# EAGLE design ember_20110430 (EAGLE 5.11)
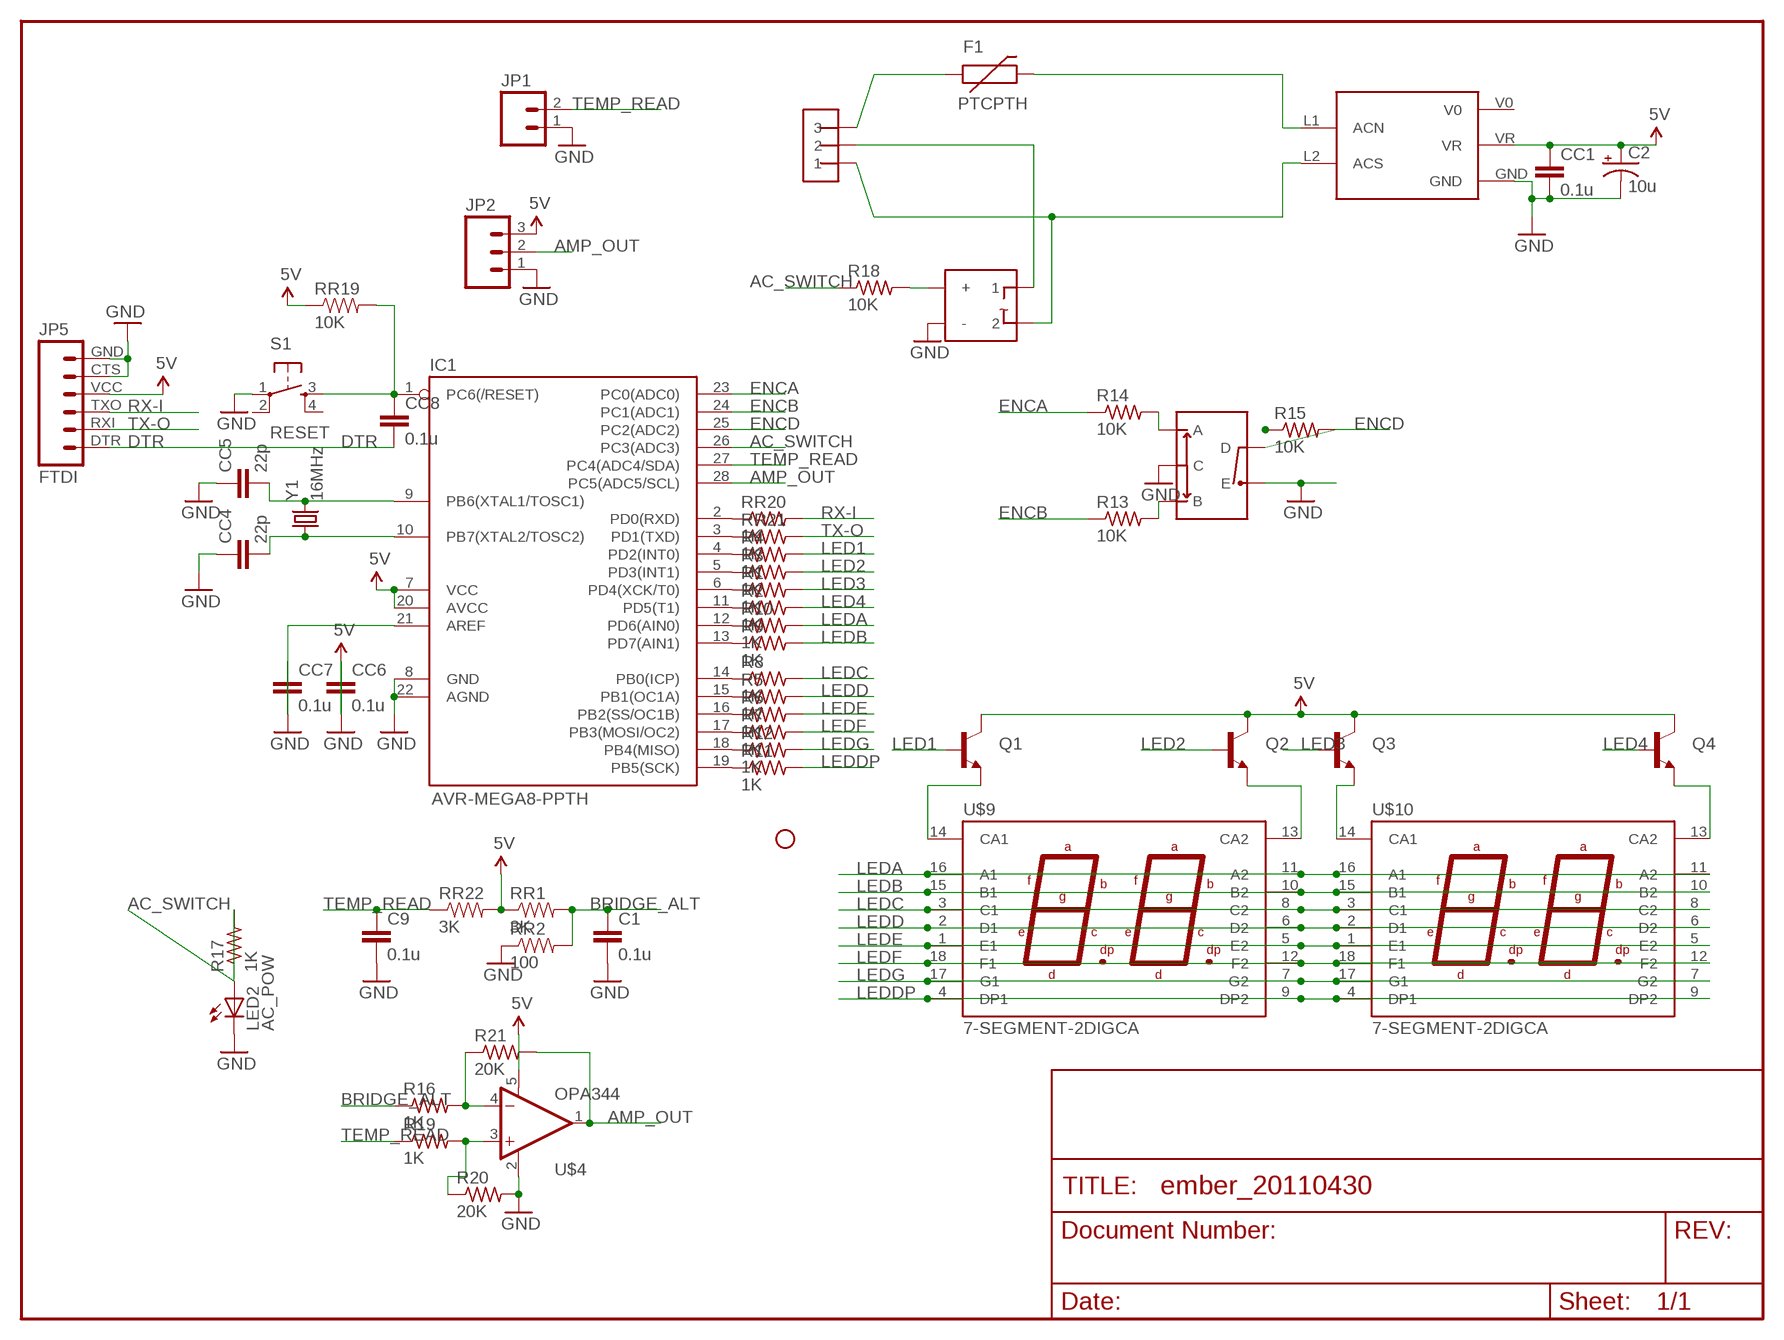
[diagram p0: schematic, sheet 1]

## Parts
C1  0.1u  CAPPTH  [CAP-PTH-SMALL]
C2  10u  CAP_POLPTH2  [CPOL-RADIAL-10UF-25V]
C9  0.1u  CAPPTH  [CAP-PTH-SMALL]
CC1  0.1u  CAPPTH  [CAP-PTH-SMALL]
CC4  22p  CAPPTH  [CAP-PTH-SMALL]
CC5  22p  CAPPTH  [CAP-PTH-SMALL]
CC6  0.1u  CAPPTH  [CAP-PTH-SMALL]
CC7  0.1u  CAPPTH  [CAP-PTH-SMALL]
CC8  0.1u  CAPPTH  [CAP-PTH-SMALL]
F1  PTCPTH  [PTC]
IC1  AVR-MEGA8-PPTH  [DIL28-3]
JP1  M023.5MM_LOCK  [SCREWTERMINAL-3.5MM-2_LOCK]
JP2  M03SCREW_LOCK  [SCREWTERMINAL-3.5MM-3_LOCK.007S]
JP5  FTDI  FTDI_BASICPTH  [FTDI_BASIC]
JP7  M03V5V75  [M03V75]
JP8  STAND-OFF  [STAND-OFF]
LED2  AC_POW  LED3MM  [LED3MM]
Q1  TRANSISTOR_NPNTO92  [TO-92]
Q2  TRANSISTOR_NPNTO92  [TO-92]
Q3  TRANSISTOR_NPNTO92  [TO-92]
Q4  TRANSISTOR_NPNTO92  [TO-92]
R1  1K  R-US_0207/2V  [0207/2V]
R2  1K  R-US_0207/2V  [0207/2V]
R3  1K  R-US_0207/2V  [0207/2V]
R4  1K  R-US_0207/2V  [0207/2V]
R5  1K  R-US_0207/2V  [0207/2V]
R6  1K  R-US_0207/2V  [0207/2V]
R7  1K  R-US_0207/2V  [0207/2V]
R8  1K  R-US_0207/2V  [0207/2V]
R9  1K  R-US_0207/2V  [0207/2V]
R10  1K  R-US_0207/2V  [0207/2V]
R11  1K  R-US_0207/2V  [0207/2V]
R12  1K  R-US_0207/2V  [0207/2V]
R13  10K  R-US_0207/2V  [0207/2V]
R14  10K  R-US_0207/2V  [0207/2V]
R15  10K  R-US_0207/2V  [0207/2V]
R16  1K  R-US_0207/2V  [0207/2V]
R17  1K  R-US_0207/2V  [0207/2V]
R18  10K  R-US_0207/2V  [0207/2V]
R19  1K  R-US_0207/2V  [0207/2V]
R20  20K  R-US_0207/2V  [0207/2V]
R21  20K  R-US_0207/2V  [0207/2V]
RR1  3K  RESISTORAXIAL-0.3  [AXIAL-0.3]
RR2  100  RESISTORAXIAL-0.3  [AXIAL-0.3]
RR19  10K  RESISTORAXIAL-0.3  [AXIAL-0.3]
RR20  1K  R-US_0207/2V  [0207/2V]
RR21  1K  R-US_0207/2V  [0207/2V]
RR22  3K  RESISTORAXIAL-0.3  [AXIAL-0.3]
S1  RESET  TAC_SWITCHPTH  [TACTILE-PTH]
U$3  POWER_SUPPLY  [BIAS_PWR_1W]
U$4  OPA344  [SOT23-5]
U$9  7-SEGMENT-2DIGCA  [7-SEGMENT-DISPLAY]
U$10  7-SEGMENT-2DIGCA  [7-SEGMENT-DISPLAY]
U$16  SSR  [SIP-SSR]
U$17  ENCODER  [ENCODER-BOURNES-PEC11]
Y1  16MHz  CRYSTALHC49UV  [HC49U-V]

## Nets
5V: C2.1(+) CC1.1 CC6.2 IC1.7(VCC) IC1.20(AVCC) JP2.3 JP5.VCC Q1.3(C) Q2.3(C) Q3.3(C) Q4.3(C) RR1.P$1 RR19.P$1 RR22.P$2 U$3.VR U$4.5(V+)
AC_SWITCH: IC1.26(PC3(ADC3)) R17.1 R18.1
AMP_OUT: IC1.28(PC5(ADC5/SCL)) JP2.2 R21.2 U$4.1(OUT)
BRIDGE_ALT: C1.1 R16.1 RR1.P$2 RR2.P$2
DTR: CC8.2 JP5.DTR
ENCA: IC1.23(PC0(ADC0)) R14.1
ENCB: IC1.24(PC1(ADC1)) R13.1
ENCD: IC1.25(PC2(ADC2)) R15.1
GND: C1.2 C2.2(-) C9.2 CC1.2 CC4.1 CC5.1 CC6.1 CC7.1 IC1.8(GND) IC1.22(AGND) JP1.1 JP2.1 JP5.CTS JP5.GND LED2.K(C) R20.2 RR2.P$1 S1.1 U$3.GND U$4.2(V-) U$16.4(-) U$17.C U$17.E
LED1: Q1.2(B) R4.2
LED2: Q2.2(B) R3.2
LED3: Q3.2(B) R1.2
LED4: Q4.2(B) R2.2
LEDA: R10.2 U$9.11(A2) U$9.16(A1) U$10.11(A2) U$10.16(A1)
LEDB: R9.2 U$9.10(B2) U$9.15(B1) U$10.10(B2) U$10.15(B1)
LEDC: R8.2 U$9.3(C1) U$9.8(C2) U$10.3(C1) U$10.8(C2)
LEDD: R5.2 U$9.2(D1) U$9.6(D2) U$10.2(D1) U$10.6(D2)
LEDDP: R11.2 U$9.4(DP1) U$9.9(DP2) U$10.4(DP1) U$10.9(DP2)
LEDE: R6.2 U$9.1(E1) U$9.5(E2) U$10.1(E1) U$10.5(E2)
LEDF: R7.2 U$9.12(F2) U$9.18(F1) U$10.12(F2) U$10.18(F1)
LEDG: R12.2 U$9.7(G2) U$9.17(G1) U$10.7(G2) U$10.17(G1)
N$1: IC1.4(PD2(INT0)) R4.1
N$2: IC1.5(PD3(INT1)) R3.1
N$3: Q4.1(E) U$10.13(CA2)
N$4: IC1.6(PD4(XCK/T0)) R1.1
N$5: LED2.A R17.2
N$6: CC5.2 IC1.9(PB6(XTAL1/TOSC1)) Y1.2
N$7: CC4.2 IC1.10(PB7(XTAL2/TOSC2)) Y1.1
N$8: IC1.11(PD5(T1)) R2.1
N$9: IC1.12(PD6(AIN0)) R10.1
N$10: IC1.13(PD7(AIN1)) R9.1
N$11: IC1.14(PB0(ICP)) R8.1
N$12: IC1.15(PB1(OC1A)) R5.1
N$13: IC1.2(PD0(RXD)) RR20.1
N$14 [1A/150]: F1.P$2 U$3.L1(ACN)
N$15: IC1.16(PB2(SS/OC1B)) R6.1
N$16: Q3.1(E) U$10.14(CA1)
N$17: Q2.1(E) U$9.13(CA2)
N$18: Q1.1(E) U$9.14(CA1)
N$19: IC1.17(PB3(MOSI/OC2)) R7.1
N$20: CC7.2 IC1.21(AREF)
N$21: IC1.18(PB4(MISO)) R12.1
N$22: IC1.19(PB5(SCK)) R11.1
N$23 [1A/150]: JP7.2 U$16.1
N$24: R18.2 U$16.3(+)
N$25: R16.2 R21.1 U$4.4(-IN)
N$26: R19.2 R20.1 U$4.3(+IN)
N$33: R14.2 U$17.A
N$34: R13.2 U$17.B
N$35: IC1.3(PD1(TXD)) RR21.1
N$36: R15.2 U$17.D
N$37 [1A/150]: F1.P$1 JP7.3
N$38 [1A/150]: JP7.1 U$3.L2(ACS) U$16.2
RESET: CC8.1 IC1.1(PC6(/RESET)) RR19.P$2 S1.3
RX-I: JP5.TXO RR20.2
TEMP_READ: C9.1 IC1.27(PC4(ADC4/SDA)) JP1.2 R19.1 RR22.P$1
TX-O: JP5.RXI RR21.2
Unconnected: S1.2 S1.4 U$3.V0

## Library data of the parts
C1 C9 CC1 CC4-CC8 = SparkFun:CAP: Capacitor Standard 0603 ceramic capacitor, and 0.1" leaded capacitor.
C2 = SparkFun:CAP_POL: Capacitor Polarized These are standard SMD and PTH capacitors. Normally 10uF, 47uF, and 100uF in electrolytic and tantalum varieties. Always verify the external diameter of the through hole cap, it varies with capacity, voltage, and manufacturer. The EIA devices should be standard.
F1 = SparkFun:PTC: Resettable Fuse PTC Resettable Fuse. Spark Fun Electronics SKU : COM-08357
IC1 = SparkFun:AVR-MEGA8-P: MICROCONTROLLER 8 Kbytes FLASH 1 kbytes SRAM 512 bytes EEPROM USART 4-channel 10 bit ADC 2-channel 8 bit ADC
JP1 = SparkFun:M02: Header 2 Standard 2-pin 0.1" header. Use with straight break away headers (SKU : PRT-00116), right angle break away headers (PRT-00553), swiss pins (PRT-00743), machine pins (PRT-00117), and female headers (PRT-00115). Molex polarized connector foot print use with SKU : PRT-08233 with associated crimp pins and housings.
JP2 = SparkFun:M03: Header 3 Standard 3-pin 0.1" header. Use with straight break away headers (SKU : PRT-00116), right angle break away headers (PRT-00553), swiss pins (PRT-00743), machine pins (PRT-00117), and female headers (PRT-00115). Molex polarized connector foot print use with SKU : PRT-08232 with associated crimp pins and housings.
JP5 = SparkFun:FTDI_BASIC: FTDI Basic: 3.3V and 5V
JP7 = User:M03V5
JP8 = SparkFun:STAND-OFF: Stand Off This is the mechanical footprint for a #4 phillips button head screw. Use the keepout ring to avoid running the screw head into surrounding components. SKU : PRT-00447
LED2 = SparkFun:LED: LEDs Standard schematic elements and footprints for 5mm, 3mm, 1206, and 0603 sized LEDs. 5mm - Spark Fun Electronics SKU : COM-00529 (and others)
Q1-Q4 = SparkFun:TRANSISTOR_NPN: Transistor NPN BJT configuration in SOT23 package. MMBT2222 is the common NPN we use. Double check BCE configuration again layout.
R1-R21 RR20 RR21 = rcl:R-US_: RESISTOR, American symbol
RR1 RR2 RR19 RR22 = SparkFun:RESISTOR: Resistor Basic schematic elements and footprints for 0603, 1206, and PTH resistors.
S1 = SparkFun:TAC_SWITCH: Momentary Switch Button commonly used for reset or general input. Spark Fun Electronics SKU : COM-00097
U$3 = User:POWER_SUPPLY
U$4 = SparkFun:OPA344
U$9 U$10 = User:7-SEGMENT-2DIG
U$16 = User:SSR
U$17 = User:ENCODER
Y1 = SparkFun:CRYSTAL: Crystals Various standard crystals. Proven footprints. Spark Fun Electronics SKU : COM-00534

## Net classes
1 10A/150: width 2.54 mm, clearance 1.854 mm
2 1A/150: width 0.102 mm, clearance 1.854 mm

## Board
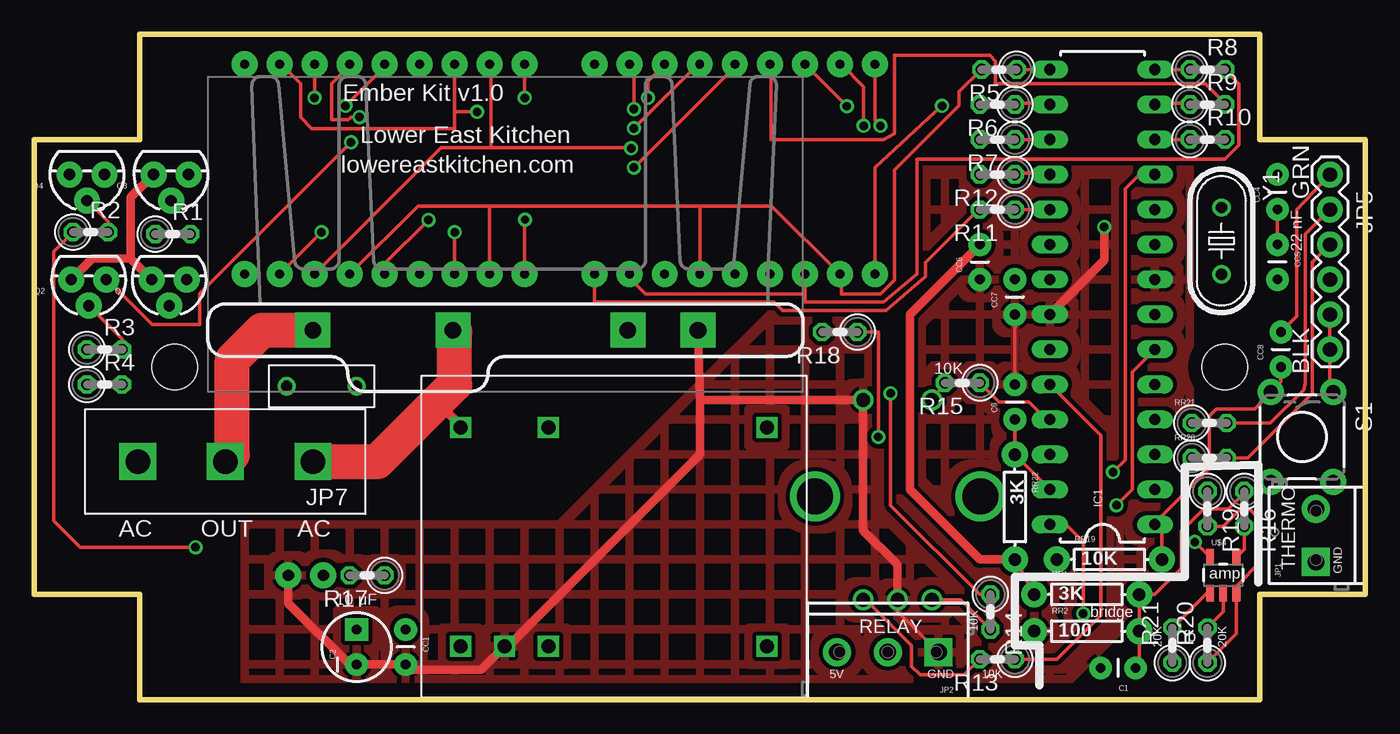
[diagram p1: board, top side]
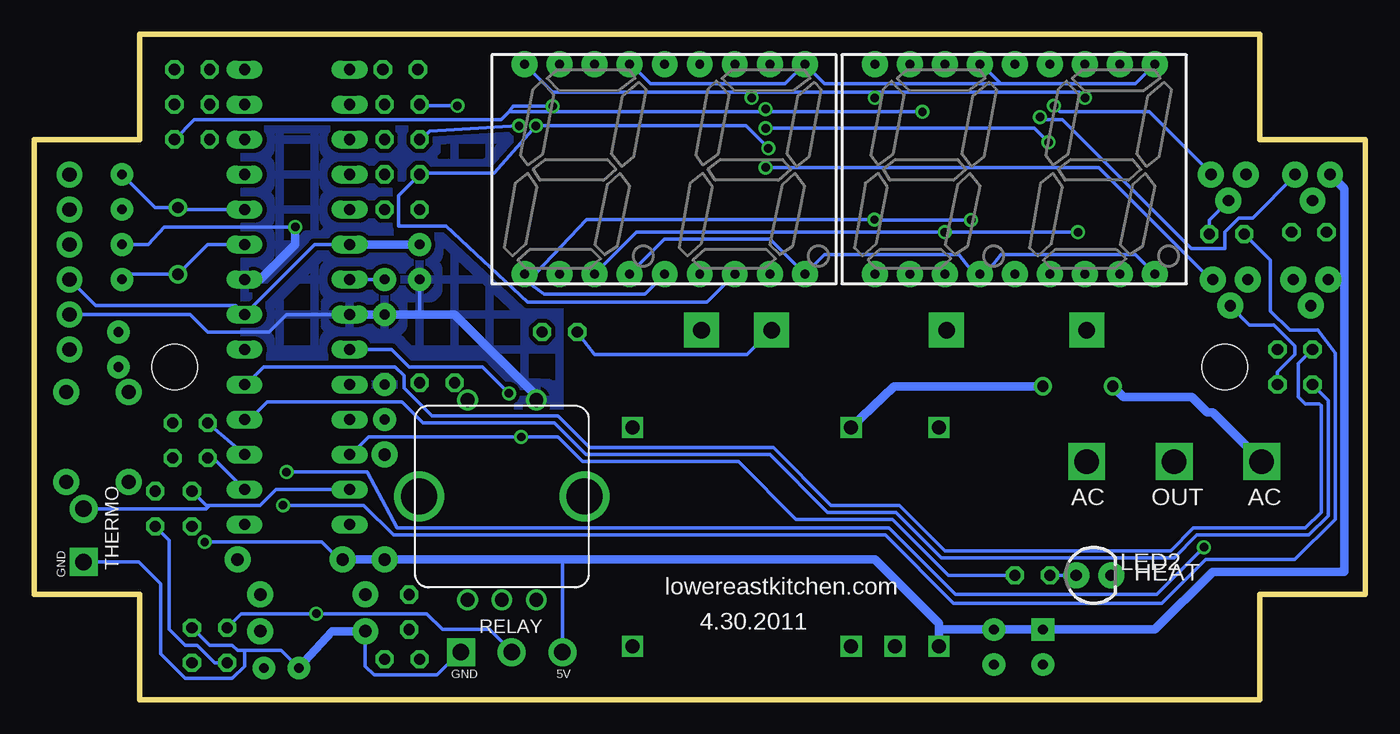
[diagram p2: board, bottom side, seen from below]

Size 96.52 x 48.26 mm. Coordinates in mm from the lower left corner, seen from the top.
Outline: 0,7.62 7.62,7.62 7.62,0 88.9,0 88.9,7.62 96.52,7.62 96.52,40.64 88.9,40.64 88.9,48.26 7.62,48.26 7.62,40.64 0,40.64 0,7.62
Copper layers (1*16): Top 0.035mm / dielectric 1.5mm / Bottom 0.035mm
Design rules "default *": minimum track width 10mil, minimum drill 24mil, track to track 8mil, track to pad 8mil, pad to pad 8mil, via to via 8mil, smd to smd 8mil, copper to edge 40mil, drill to drill 8mil, minimum pad ring 10mil, minimum via ring 8mil, stop-mask expansion 4mil, vias tented up to drill 25mil, thermal gap 10mil

### Footprints (pad centres in the part's own frame; a part is rotated, then mirrored left to right if it is on the bottom)
CAP-PTH-SMALL = drill 0.7 pad 1.651 round: 1 0,0; 2 2.54,0
CPOL-RADIAL-10UF-25V = drill 0.7 pad 1.651 square: 1 1.27,0 | drill 0.7 pad 1.651 round: 2 -1.27,0
PTC = drill 0.8 round: P$1 -2.54,0; P$2 2.54,0
DIL28-3 = drill 0.813 long: 1 -16.51,-3.81; 2 -13.97,-3.81; 3 -11.43,-3.81; 4 -8.89,-3.81; 5 -6.35,-3.81; 6 -3.81,-3.81; 7 -1.27,-3.81; 8 1.27,-3.81; 9 3.81,-3.81; 10 6.35,-3.81; 11 8.89,-3.81; 12 11.43,-3.81; 13 13.97,-3.81; 14 16.51,-3.81; 15 16.51,3.81; 16 13.97,3.81; 17 11.43,3.81; 18 8.89,3.81; 19 6.35,3.81; 20 3.81,3.81; 21 1.27,3.81; 22 -1.27,3.81; 23 -3.81,3.81; 24 -6.35,3.81; 25 -8.89,3.81; 26 -11.43,3.81; 27 -13.97,3.81; 28 -16.51,3.81
SCREWTERMINAL-3.5MM-2_LOCK = drill 1.2 pad 2.032 square: 1 -0.178,0 | drill 1.2 pad 2.032 round: 2 3.678,0
SCREWTERMINAL-3.5MM-3_LOCK.007S = drill 1.2 pad 2.032 square: 1 -0.178,0 | drill 1.2 pad 2.032 round: 2 3.5,0; 3 7.178,0
FTDI_BASIC = drill 1.016 pad 1.88 round: CTS 10.16,0; DTR 0,0; GND 12.7,0; RXI 2.54,0; TXO 5.08,0; VCC 7.62,0
M03V75 = drill 1.778 square: 1 -6.35,0; 2 0,0; 3 6.35,0
STAND-OFF = hole 3.302: 0,0
LED3MM = drill 0.813 pad 1.88 round: A -1.27,0; K 1.27,0
TO-92 = drill 0.813 pad 1.88 round: 1 -1.27,0; 2 0,1.905; 3 1.27,0
0207/2V = drill 0.813 octagon: 1 -1.27,0; 2 1.27,0
AXIAL-0.3 = drill 0.9 pad 1.88 round: P$1 -3.81,0; P$2 3.81,0
TACTILE-PTH = drill 1.016 pad 1.88 round: 1 -3.251,2.261; 2 3.251,2.261; 3 -3.251,-2.261; 4 3.251,-2.261
BIAS_PWR_1W = drill 1.016 square: GND 7.938,7.938; L1 4.763,-7.938; L2 11.113,-7.938; NC1 -11.113,7.938; NC2 -11.113,-7.938; V0 4.763,7.938; VR 11.113,7.938
SOT23-5 = smd 0.55 x 1.2: 1 -0.95,-1.3; 2 0,-1.3; 3 0.95,-1.3; 4 0.95,1.3; 5 -0.95,1.3
7-SEGMENT-DISPLAY = drill 0.65 pad 1.88 round: 1 -10.16,-7.62; 2 -7.62,-7.62; 3 -5.08,-7.62; 4 -2.54,-7.62; 5 0,-7.62; 6 2.54,-7.62; 7 5.08,-7.62; 8 7.62,-7.62; 9 10.16,-7.62; 10 10.16,7.62; 11 7.62,7.62; 12 5.08,7.62; 13 2.54,7.62; 14 0,7.62; 15 -2.54,7.62; 16 -5.08,7.62; 17 -7.62,7.62; 18 -10.16,7.62
SIP-SSR = drill 1.2 pad 2.54 square: 1 -13.97,-6.985; 2 -3.81,-6.985; 3 8.89,-6.985; 4 13.97,-6.985
ENCODER-BOURNES-PEC11 = drill 1 round: A -2.5,-7.5; B 2.5,-7.5; C 0,-7.5; D -2.5,7; E 2.5,7 | drill 2.6 round: P$1 6,0; P$2 -6,0
HC49U-V = drill 0.813 round: 1 -2.413,0; 2 2.413,0

### Placement (x,y rotation side)
C1  79.88,2.29 180 top
C2  23.37,3.81 90 top
C9  71.12,20.32 90 top
CC1  26.92,5.08 270 top
CC4  90.17,35.56 90 top
CC5  90.17,33.02 270 top
CC6  68.58,30.48 90 top
CC7  71.12,27.94 90 top
CC8  90.42,24.13 90 top
F1  20.83,22.73 0 top
IC1  77.47,29.21 90 top
JP1  92.96,10.16 90 top
JP2  65.41,3.43 180 top
JP5  93.98,38.1 270 top
JP7  13.84,17.27 180 top
JP8  10.16,24.13 0 top
JP9  STAND-OFF  [STAND-OFF]  86.36,24.13 0 top
LED2  19.68,9.02 0 bottom
Q1  9.78,30.48 180 top
Q2  3.94,30.48 180 top
Q3  9.91,38.1 180 top
Q4  3.81,38.1 180 top
R1  10.03,33.78 0 top
R2  4.06,33.91 0 top
R3  5.08,25.4 0 top
R4  5.08,22.86 0 top
R5  69.98,45.72 180 top
R6  69.85,43.18 180 top
R7  69.85,40.64 180 top
R8  85.09,45.72 0 top
R9  85.09,43.18 0 top
R10  85.09,40.64 0 top
R11  69.85,35.56 180 top
R12  69.85,38.1 180 top
R13  69.85,2.92 180 top
R14  69.34,6.35 270 top
R15  67.31,22.99 180 top
R16  87.76,13.84 270 top
R17  24.13,9.02 180 top
R18  58.42,26.67 180 top
R19  85.09,13.84 270 top
R20  85.09,3.94 90 top
R21  82.55,3.94 90 top
RR1  76.33,7.62 0 top
RR2  76.33,4.95 0 top
RR19  77.98,10.16 0 top
RR20  85.22,17.53 0 top
RR21  85.22,20.07 0 top
RR22  71.12,13.97 270 top
S1  91.95,19.05 270 top
U$3  42.04,11.81 180 top
U$4  86.23,9.02 0 top
U$9  50.8,38.48 0 bottom
U$10  25.4,38.48 0 bottom
U$16  34.16,33.78 0 top
U$17  62.61,14.73 0 bottom
Y1  86.11,33.27 270 top

### Tracks (layer width: path | path; a pad name or v marks a point on that pad's centre or on a via)
5V  (via drill 0.61)
  Top 0.254: RR22.P$2 RR1.P$1 | v84.17,11.43 U$4.5
  Top 0.61: CC6.2 63.5,27.94 63.5,15.24 68.58,10.16 RR22.P$2 | Q2.3 4.19,32 6.99,32 | 6.99,32 Q1.3 | Q3.3 6.99,36.45 6.99,32
  Bottom 0.254: JP5.VCC 92.08,28.57 81.92,28.57 IC1.7 76.2,33.02 IC1.20 | 58.42,10.16 58.29,10.03 58.23,9.97 JP2.3 | RR19.P$1 74.42,10.16 75.69,11.43 v84.17,11.43
  Bottom 0.61: 30.92,5.08 U$3.VR | 30.92,5.08 30.92,5.52 35.56,10.16 58.42,10.16 RR22.P$2 RR19.P$1 | 30.92,5.08 CC1.1 C2.1 15.24,5.08 11.05,9.27 1.52,9.27 1.52,30.48 | CC6.2 IC1.20 | 1.52,30.48 Q2.3 | Q4.3 1.52,37.08 1.52,30.48
AC_SWITCH  (via drill 0.61)
  Top 0.254: v61.21,19.05 61.21,26.67 R18.1
  Bottom 0.254: IC1.26 73.53,17.78 72.26,19.05 v61.21,19.05 58.55,19.05 56.77,17.27 45.47,17.27 41.27,13.08 34.29,13.08 30.23,9.02 R17.1
AMP_OUT  (via drill 0.61)
  Top 0.254: U$4.1 85.06,7.72 R21.2 | IC1.28 74.8,12.7 76.07,11.43 v76.07,6.22
  Bottom 0.254: R21.2 81.53,6.22 v76.07,6.22 68.07,6.22 66.93,5.08 63.5,5.08 61.91,3.48 JP2.2
BRIDGE_ALT
  Top 0.254: C1.1 80.14,2.54 RR2.P$2 RR1.P$2 81.28,7.62 83.19,9.53 83.19,12.19 84.84,13.84 86.61,13.84 87.76,14.99 R16.1
DTR
  Top 0.254: JP5.DTR 91.57,35.56 91.57,27.81 CC8.2
ENCA  (via drill 0.61)
  Top 0.254: v62.1,22.23 62.1,14.1 68.58,7.62 R14.1
  Bottom 0.254: IC1.23 70.61,25.4 69.34,24.13 64.01,24.13 v62.1,22.23
ENCB
  Top 0.254: IC1.24 77.34,19.18 77.34,6.1 74.17,2.92 R13.1
ENCD
  Top 0.254: IC1.25 73.41,20.32 72.14,21.59 69.98,21.59 R15.1
GND  (via drill 0.61)
  Top 0.254: 62.36,7.23 U$17.C 62.61,6.4 JP2.1 | CC7.1 C9.2 | JP5.CTS JP5.GND 93.98,22.53 S1.1 | CC5.1 CC4.1 | U$4.2 86.23,6.35 R20.2
  Top 0.61: 48.26,21.84 48.26,17.78 34.35,3.87 U$3.GND 32.38,2.16 27.05,2.16 CC1.2 C2.2 22.86,2.54 18.41,6.99 LED2.K | 48.26,21.84 U$16.4 | U$17.C 62.61,9.78 62.48,9.91 60.11,12.27 U$17.E 48.37,21.73 48.26,21.84 | v77.6,34.29 77.6,31.88 IC1.22
  Bottom 0.254: 68.58,27.94 CC6.1 | IC1.22 78.23,27.94 79.5,26.67 83.95,26.67 85.22,27.94 JP5.CTS | CC5.1 88.27,33.02 87.12,34.29 v77.6,34.29 | C1.2 78.61,3.56 81.28,3.56 | 81.28,3.56 81.79,3.56 82.17,3.94 83.82,3.94 R20.2 | JP1.1 88.98,9.98 87.38,8.38 87.38,3.3 85.6,1.52 82.17,1.52 81.28,2.41 81.28,3.56 | JP2.1 65.66,3.43 67.31,1.78 71.88,1.78 72.52,2.41 RR2.P$1
  Bottom 0.61: U$17.E 59.86,21.76 66.04,27.94 68.58,27.94 CC7.1 IC1.22 | IC1.8 80.14,30.48 77.6,33.02 v77.6,34.29 | RR2.P$1 74.93,4.95 C1.2
  pour Top (isolate 0.305, hatched): 27.94,0 73.66,0 83.82,10.16 83.82,48.26 63.5,48.26 63.5,38.1 38.1,12.7 15.24,12.7 15.24,0
  pour Bottom (isolate 0.305, hatched): 58.42,30.48 58.42,20.32 58.42,17.78 68.58,7.62 81.28,7.62 81.28,48.26 58.42,48.26
LED1
  Bottom 0.254: R4.2 6.35,23.75 5.08,25.02 5.08,25.65 6.6,27.18 8.38,27.18 Q1.2
LED2
  Top 0.254: R3.2 6.35,26.16 Q2.2
LED3
  Bottom 0.254: R1.2 11.3,34.8 Q3.2
LED4
  Top 0.254: R2.2 5.33,34.67 Q4.2
LEDA  (via drill 0.61)
  Top 0.254: 30.48,42.65 U$10.16 | 30.48,42.65 30.48,41.43 20.12,41.43 19.3,42.24 19.3,44.68 17.88,46.1 U$10.11 | v58.93,43.05 U$9.16 | v43.48,42.85 43.48,45.9 43.28,46.1 U$9.11 | 30.48,42.65 v32.11,42.65
  Bottom 0.254: R10.2 84.94,42.06 62.66,42.06 62.08,42.65 | 62.08,42.65 61.8,43.05 v58.93,43.05 | 43.69,42.65 62.08,42.65 | v32.11,42.65 43.69,42.65 | 43.69,42.65 v43.48,42.85
LEDB
  Top 0.254: R9.2 86.36,43.28 84.94,44.7 69.7,44.7 69.7,46.33 69.29,46.74 62.38,46.74 62.38,41.05 61.57,40.62 53.44,40.62 53.44,46.1 U$9.15
  Bottom 0.254: U$10.10 16.66,44.68 26.42,44.68 | 26.42,44.68 27.84,46.1 U$10.15 | 26.42,44.68 39.22,44.68 U$9.10 42.06,44.68 51.82,44.68 53.24,46.1 U$9.15
LEDC  (via drill 0.61)
  Top 0.254: R8.2 87.38,44.7 87.38,40.23 86.36,39.22 64.01,39.22 64.01,30.89 61.57,28.83 55.88,28.83 55.88,29.44 | U$9.3 55.88,29.44 | 55.88,29.44 44.32,29.44 43.28,30.48 U$9.8 | v30.48,33.91 U$10.3 | U$10.8 v20.83,33.91
  Bottom 0.254: v20.83,33.91 v30.48,33.91 52.83,33.91 U$9.3
LEDD
  Top 0.254: R5.2 68.68,45.72 67.06,44.09 67.06,43.08 62.38,38.41 62.38,30.45 61.37,29.44 58.52,29.44 58.52,30.48 U$9.2 53.47,35.81 48.26,35.81 | U$10.6 27.81,35.81 33.02,35.81 | 48.26,35.81 U$9.6 | 33.02,35.81 U$10.2 | 33.02,35.81 48.26,35.81
LEDDP
  Top 0.254: U$9.9 40.64,28.83 53.65,28.83 54.25,28.22 61.77,28.22 64.62,30.68 64.62,31.7 68.48,35.56 R11.2
  Bottom 0.254: U$10.9 16.66,32.28 26.42,32.28 27.84,30.48 U$10.4 28.04,30.48 29.46,32.28 39.22,32.28 U$9.9 43.18,33.4 50.8,33.4 U$9.4
LEDE  (via drill 0.61)
  Top 0.254: v65.84,43.08 60.96,38.58 U$9.1 | U$10.1 35.56,34.04 v35.59,34.82 | U$10.5 25.4,31.62 v28.57,34.8
  Bottom 0.254: v65.84,43.08 68.48,43.08 R6.2 | U$9.5 52.22,29.44 59.54,29.44 60.76,30.28 | 60.76,30.28 56.46,34.82 v35.59,34.82 35.61,34.8 v28.57,34.8 | 60.76,30.28 U$9.1
LEDF  (via drill 0.61)
  Top 0.254: v61.37,41.63 60.96,42.04 U$9.18 | v20.32,43.66 U$10.12 | v35.56,43.66 U$10.18 | U$9.12 44.5,44.88 v44.5,43.66
  Bottom 0.254: v61.37,41.63 67.87,41.25 68.48,40.64 R7.2 | v20.32,43.66 20.73,44.07 35.56,44.07 | 44.5,44.07 58.93,44.07 U$9.18 | 35.56,44.07 44.5,44.07 | 35.56,44.07 v35.56,43.66 | 44.5,44.07 v44.5,43.66
LEDG  (via drill 0.61)
  Top 0.254: U$10.7 29.52,40.06 33.12,40.06 | 33.12,40.06 33.12,46.1 U$10.17 | v60.15,41.63 60.15,44.48 58.52,46.1 U$9.17 | 33.12,40.06 43.28,40.06 v43.28,40.01
  Bottom 0.254: U$9.7 47.75,28.83 60.76,28.83 66.65,34.34 70.1,34.34 70.1,36.58 R12.2 68.48,38.2 63.2,38.2 v60.15,41.63 44.91,41.63 v43.28,40.01
N$1
  Bottom 0.254: IC1.4 80.9,20.32 79.63,21.59 69.85,21.59 68.33,20.07 58.8,20.07 56.52,17.78 43.18,17.78 38.99,13.59 34.04,13.59 30.73,10.29 13.84,10.29 12.19,11.94 4.06,11.94 2.67,13.34 2.67,21.72 R4.1
N$2
  Bottom 0.254: IC1.5 81.15,22.86 79.88,24.13 70.36,24.13 69.72,23.5 69.72,22.61 67.69,20.57 58.55,20.57 56.26,18.29 42.93,18.29 38.73,14.1 33.78,14.1 30.48,10.79 14.1,10.79 12.45,12.45 4.32,12.45 3.17,13.59 3.17,21.34 3.3,21.46 4.32,21.46 4.83,21.97 4.83,24.38 R3.1
N$3  (via drill 0.61)
  Top 0.254: v23.57,42.27 22.96,42.27 22.76,42.06 21.54,42.06 21.54,44.7 22.76,45.92 U$10.13
  Bottom 0.254: v23.57,42.27 23.37,42.06 21.95,42.06 12.6,32.72 10.16,32.72 10.16,33.93 9.14,34.95 8.13,34.95 5.08,38 Q4.1
N$4  (via drill 0.61)
  Top 0.254: IC1.6 79.63,23.75 79.63,15.24 v78.49,14.1
  Bottom 0.254: v78.49,14.1 72.64,14.1 70.48,11.94 34.8,11.94 29.84,6.99 14.73,6.99 11.56,10.16 5.08,10.16 2.16,13.08 2.16,25.15 3.43,26.8 5.46,26.8 6.86,28.19 6.86,31.88 R1.1
N$5
  Bottom 0.254: LED2.A R17.2
N$6
  Bottom 0.254: IC1.9 83.95,33.02 Y1.2 89.79,30.86 CC5.2
N$7
  Bottom 0.254: IC1.10 85.98,35.56 Y1.1 87.76,35.69 CC4.2
N$8  (via drill 0.61)
  Top 0.254: IC1.11 80.14,38.1 79.12,37.08 79.12,17.4 v78.23,16.51 | R2.1 1.4,32.51 1.4,12.95 3.3,11.05 v11.68,11.05
  Bottom 0.254: v78.23,16.51 72.39,16.51 70.23,12.45 34.54,12.45 29.72,7.62 15.11,7.62 v11.68,11.05
N$9
  Top 0.254: IC1.12 R10.1
N$10
  Top 0.254: IC1.13 81.28,43.28 83.72,43.28 R9.1
N$11
  Top 0.254: IC1.14 R8.1
N$12
  Top 0.254: R5.1 IC1.15
N$13
  Bottom 0.254: RR20.1 83.57,17.53 IC1.2
N$14
  Bottom 0.61: F1.P$2 34.16,22.73 U$3.L1
N$15
  Top 0.254: R6.1 71.12,43.28 73.56,43.28 IC1.16
N$16  (via drill 0.61)
  Top 0.254: v22.55,43.08 25.4,45.92 U$10.14
  Bottom 0.254: v22.55,43.08 22.15,42.67 15.65,42.67 11.18,38.2 Q3.1
N$17  (via drill 0.61)
  Top 0.254: v22.96,40.44 11.99,29.46 11.99,27.23 8.53,27.23 5.28,30.48 Q2.1 | v43.48,41.45 48.16,46.13 U$9.13
  Bottom 0.254: v22.96,40.44 23.98,41.45 v43.48,41.45
N$18  (via drill 0.61)
  Top 0.254: v43.48,38.61 50.8,45.92 U$9.14
  Bottom 0.254: v43.48,38.61 19.3,38.61 11.18,30.48 Q1.1
N$19
  Top 0.254: R7.1 IC1.17
N$20
  Bottom 0.254: CC7.2 IC1.21
N$21
  Top 0.254: R12.1 71.12,38.2 73.56,38.2 IC1.18
N$22
  Top 0.254: R11.1 IC1.19
N$23
  Top 2.54: U$16.1 16.51,26.8 14.35,24.64 14.35,17.78 JP7.2
N$24
  Bottom 0.254: R18.2 55.88,25.02 44.83,25.02 U$16.3
N$25
  Top 0.254: R16.2 87.76,10.89 U$4.4
  Bottom 0.254: R21.1 83.44,2.67 84.71,3.94 85.6,3.94 86.74,5.08 86.74,11.56 R16.2
N$26
  Top 0.254: R20.1 87.18,4.76 U$4.3 87.18,8.19 87.38,8.38 88.86,9.91 88.9,13.08 88.14,13.84 87.5,13.84 86.23,12.57 R19.2
N$33
  Top 0.254: U$17.A 67.19,7.23 R14.2
N$34
  Top 0.254: U$17.B 60.33,7.23 63.63,3.94 63.63,2.41 64.26,1.78 67.44,1.78 R13.2
N$35
  Bottom 0.254: IC1.3 RR21.1
N$36
  Top 0.254: R15.2 66.04,22.96 65.15,21.82 65.02,21.74 U$17.D
N$37
  Bottom 0.61: F1.P$1 17.53,21.97 12.57,21.97 11.43,20.83 11.05,20.83 JP7.3
N$38
  Top 0.61: U$3.L2 30.92,19.88 29.21,21.59
  Top 2.54: JP7.1 24.89,17.27 29.21,21.59 30.48,22.86 30.48,26.67 U$16.2
RESET
  Top 0.254: RR19.P$2 81.79,12.19 IC1.1 81.28,12.83 81.41,12.95 85.22,16.76 85.22,20.57 85.72,21.08 88.52,21.08 89.69,22.25 S1.3 90.42,23.04 CC8.1
RX-I
  Top 0.254: JP5.TXO 92.71,31.75 92.71,22.23 88.01,17.53 RR20.2
TEMP_READ
  Top 0.254: C9.1 RR22.P$1 IC1.27
  Bottom 0.254: IC1.27 78.99,15.24 80.14,14.1 83.82,14.1 | 83.82,14.1 84.07,14.1 R19.1 | JP1.2 84.08,13.84 83.82,14.1
TX-O
  Top 0.254: JP5.RXI 92.2,33.78 92.2,22.99 92.08,22.48 89.66,20.07 RR21.2

### Text on the board
tPlace: Ember Kit v1.0 | Lower East Kitchen | lowereastkitchen.com | GRN | 22 nF | 10K | BLK | AC | OUT | AC | amp | THERMO | GND | 10 uF | bridge | RELAY | 10K | 20K | fb | 20K | 5V | GND | 10K
bPlace: AC | OUT | AC | GND | HEAT | THERMO | lowereastkitchen.com | 4.30.2011 | RELAY | 5V | GND